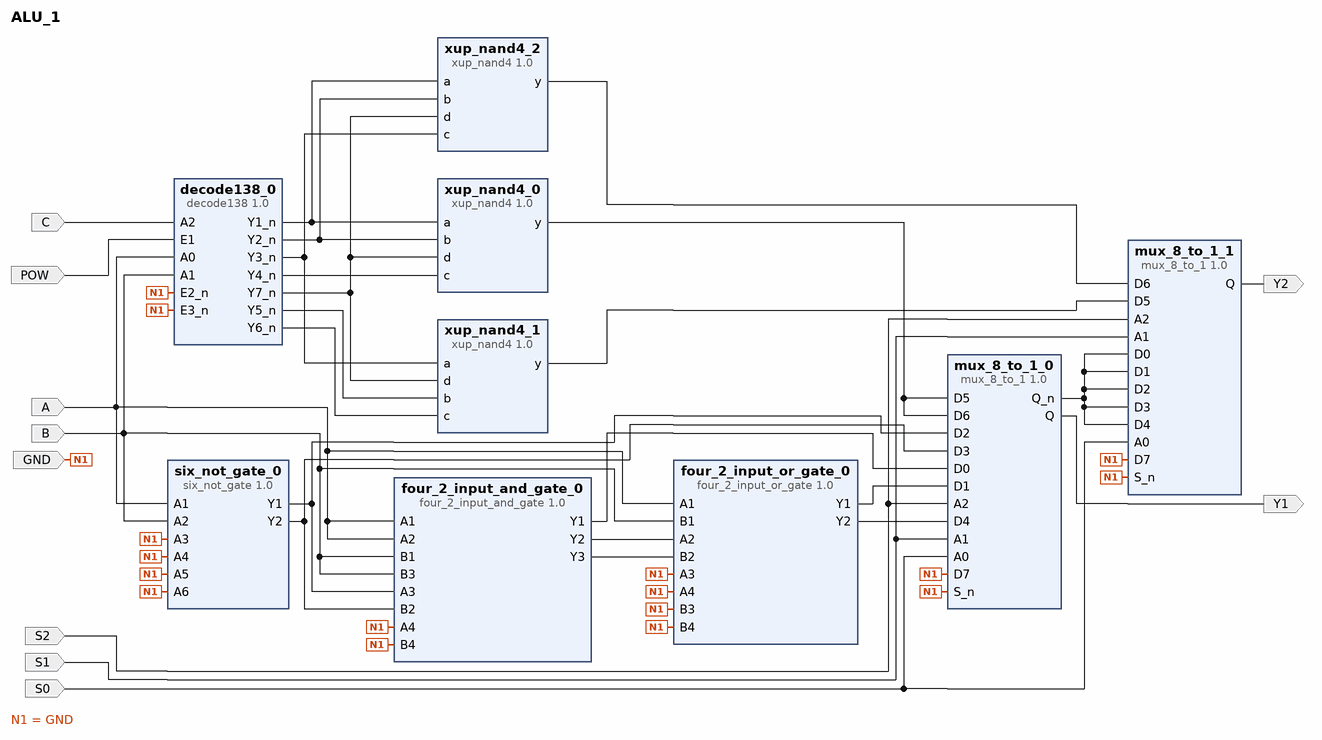
[diagram p0: block diagram of the top level]
# Vivado block design ALU_1, Vivado 2015.3
create_bd_design ALU_1

create_bd_port -dir I -type data A
create_bd_port -dir I -type data B
create_bd_port -dir I -type data C
create_bd_port -dir I -type data S2
create_bd_port -dir I -type data S1
create_bd_port -dir I -type data S0
create_bd_port -dir O -type data Y1
create_bd_port -dir O -type data Y2
create_bd_port -dir I -type data GND
create_bd_port -dir I -type data POW

create_bd_cell -type ip -vlnv xilinx.com:XUP:four_2_input_and_gate:1.0 four_2_input_and_gate_0
create_bd_cell -type ip -vlnv xilinx.com:xup:mux_8_to_1:1.0 mux_8_to_1_0
create_bd_cell -type ip -vlnv xilinx.com:xup:mux_8_to_1:1.0 mux_8_to_1_1
create_bd_cell -type ip -vlnv xilinx.com:XUP:four_2_input_or_gate:1.0 four_2_input_or_gate_0
create_bd_cell -type ip -vlnv xilinx.com:XUP:six_not_gate:1.0 six_not_gate_0
create_bd_cell -type ip -vlnv xilinx.com:XUP:decode138:1.0 decode138_0
create_bd_cell -type ip -vlnv xilinx.com:xup:xup_nand4:1.0 xup_nand4_0
create_bd_cell -type ip -vlnv xilinx.com:xup:xup_nand4:1.0 xup_nand4_1
create_bd_cell -type ip -vlnv xilinx.com:xup:xup_nand4:1.0 xup_nand4_2

# ---- connections ----

connect_bd_net -net S2_1 [get_bd_ports S2] [get_bd_pins mux_8_to_1_1/A2] [get_bd_pins mux_8_to_1_0/A2]
connect_bd_net -net S1_1 [get_bd_ports S1] [get_bd_pins mux_8_to_1_1/A1] [get_bd_pins mux_8_to_1_0/A1]
connect_bd_net -net S0_1 [get_bd_ports S0] [get_bd_pins mux_8_to_1_1/A0] [get_bd_pins mux_8_to_1_0/A0]
connect_bd_net [get_bd_ports A] \
  [get_bd_pins four_2_input_and_gate_0/A1] [get_bd_pins four_2_input_or_gate_0/A1] [get_bd_pins six_not_gate_0/A1] \
  [get_bd_pins four_2_input_and_gate_0/A2] [get_bd_pins decode138_0/A0]
connect_bd_net [get_bd_ports B] \
  [get_bd_pins four_2_input_and_gate_0/B1] [get_bd_pins four_2_input_or_gate_0/B1] [get_bd_pins six_not_gate_0/A2] \
  [get_bd_pins four_2_input_and_gate_0/B3] [get_bd_pins decode138_0/A1]
connect_bd_net [get_bd_pins four_2_input_and_gate_0/Y1] [get_bd_pins mux_8_to_1_0/D0]
connect_bd_net [get_bd_pins mux_8_to_1_0/Q] [get_bd_ports Y1]
connect_bd_net [get_bd_pins mux_8_to_1_1/Q] [get_bd_ports Y2]
connect_bd_net [get_bd_pins mux_8_to_1_0/Q_n] \
  [get_bd_pins mux_8_to_1_1/D0] [get_bd_pins mux_8_to_1_1/D1] [get_bd_pins mux_8_to_1_1/D2] [get_bd_pins mux_8_to_1_1/D3] \
  [get_bd_pins mux_8_to_1_1/D4]
connect_bd_net [get_bd_pins four_2_input_or_gate_0/Y1] [get_bd_pins mux_8_to_1_0/D1]
connect_bd_net [get_bd_pins six_not_gate_0/Y1] [get_bd_pins mux_8_to_1_0/D2] [get_bd_pins four_2_input_and_gate_0/A3]
connect_bd_net [get_bd_pins six_not_gate_0/Y2] [get_bd_pins mux_8_to_1_0/D3] [get_bd_pins four_2_input_and_gate_0/B2]
connect_bd_net [get_bd_pins four_2_input_and_gate_0/Y2] [get_bd_pins four_2_input_or_gate_0/A2]
connect_bd_net [get_bd_pins four_2_input_and_gate_0/Y3] [get_bd_pins four_2_input_or_gate_0/B2]
connect_bd_net [get_bd_pins four_2_input_or_gate_0/Y2] [get_bd_pins mux_8_to_1_0/D4]
connect_bd_net [get_bd_ports C] [get_bd_pins decode138_0/A2]
connect_bd_net [get_bd_pins decode138_0/Y1_n] [get_bd_pins xup_nand4_0/a] [get_bd_pins xup_nand4_2/a]
connect_bd_net [get_bd_pins decode138_0/Y2_n] [get_bd_pins xup_nand4_0/b] [get_bd_pins xup_nand4_2/b]
connect_bd_net [get_bd_pins decode138_0/Y4_n] [get_bd_pins xup_nand4_0/c]
connect_bd_net [get_bd_pins decode138_0/Y7_n] [get_bd_pins xup_nand4_0/d] [get_bd_pins xup_nand4_1/d] [get_bd_pins xup_nand4_2/d]
connect_bd_net [get_bd_pins xup_nand4_0/y] [get_bd_pins mux_8_to_1_0/D5] [get_bd_pins mux_8_to_1_0/D6]
connect_bd_net [get_bd_pins decode138_0/Y3_n] [get_bd_pins xup_nand4_1/a] [get_bd_pins xup_nand4_2/c]
connect_bd_net [get_bd_pins decode138_0/Y5_n] [get_bd_pins xup_nand4_1/b]
connect_bd_net [get_bd_pins decode138_0/Y6_n] [get_bd_pins xup_nand4_1/c]
connect_bd_net [get_bd_pins xup_nand4_1/y] [get_bd_pins mux_8_to_1_1/D5]
connect_bd_net [get_bd_pins xup_nand4_2/y] [get_bd_pins mux_8_to_1_1/D6]
connect_bd_net [get_bd_ports GND] \
  [get_bd_pins decode138_0/E2_n] [get_bd_pins decode138_0/E3_n] [get_bd_pins four_2_input_and_gate_0/A4] \
  [get_bd_pins four_2_input_and_gate_0/B4] [get_bd_pins four_2_input_or_gate_0/A3] [get_bd_pins four_2_input_or_gate_0/A4] \
  [get_bd_pins four_2_input_or_gate_0/B3] [get_bd_pins four_2_input_or_gate_0/B4] [get_bd_pins mux_8_to_1_0/D7] \
  [get_bd_pins mux_8_to_1_0/S_n] [get_bd_pins mux_8_to_1_1/D7] [get_bd_pins mux_8_to_1_1/S_n] [get_bd_pins six_not_gate_0/A3] \
  [get_bd_pins six_not_gate_0/A4] [get_bd_pins six_not_gate_0/A5] [get_bd_pins six_not_gate_0/A6]
connect_bd_net [get_bd_ports POW] [get_bd_pins decode138_0/E1]

validate_bd_design
save_bd_design
